# EAGLE schematic CHIP4 DUT Adapter Board (EAGLE 7.1.0)
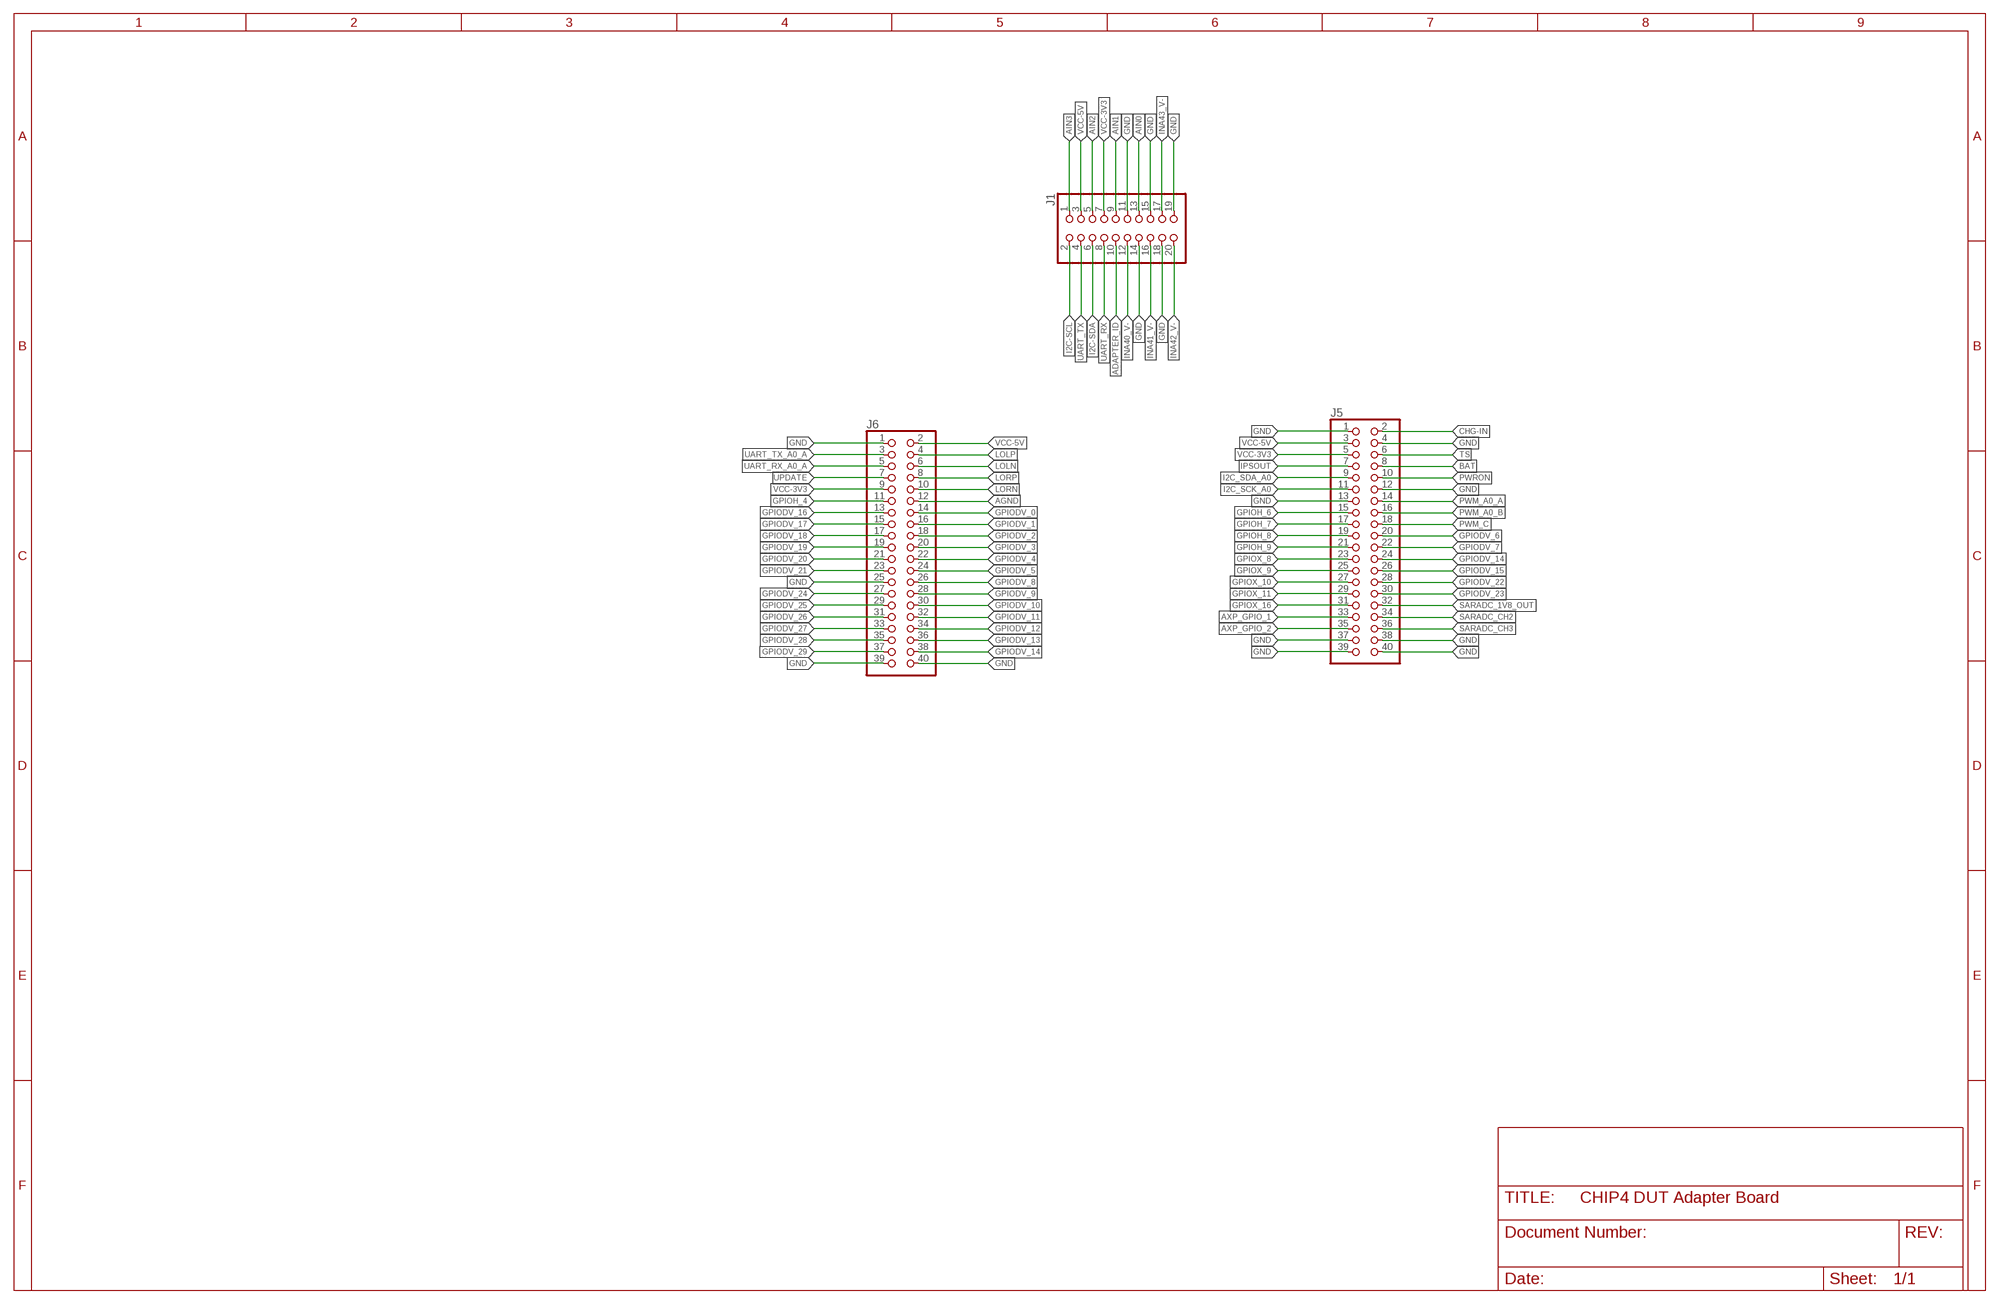
[diagram p0: schematic, sheet 1]

## Parts
J1  PINHD-2X10  [2X10]
J5  PINHD-2X20  [2X20]
J6  PINHD-2X20  [2X20]

## Nets
ADAPTER_ID: J1.10
AGND: J6.12
AIN0: J1.13
AIN1: J1.9
AIN2: J1.5
AIN3: J1.1
AXP_GPIO_1: J5.33
AXP_GPIO_2: J5.35
BAT: J5.8
CHG-IN: J5.2
GND: J1.11 J1.14 J1.15 J1.18 J1.19 J5.1 J5.4 J5.12 J5.13 J5.37 J5.38 J5.39 J5.40 J6.1 J6.25 J6.39 J6.40
GPIODV_0: J6.14
GPIODV_1: J6.16
GPIODV_2: J6.18
GPIODV_3: J6.20
GPIODV_4: J6.22
GPIODV_5: J6.24
GPIODV_6: J5.20
GPIODV_7: J5.22
GPIODV_8: J6.26
GPIODV_9: J6.28
GPIODV_10: J6.30
GPIODV_11: J6.32
GPIODV_12: J6.34
GPIODV_13: J6.36
GPIODV_14: J5.24 J6.38
GPIODV_15: J5.26
GPIODV_16: J6.13
GPIODV_17: J6.15
GPIODV_18: J6.17
GPIODV_19: J6.19
GPIODV_20: J6.21
GPIODV_21: J6.23
GPIODV_22: J5.28
GPIODV_23: J5.30
GPIODV_24: J6.27
GPIODV_25: J6.29
GPIODV_26: J6.31
GPIODV_27: J6.33
GPIODV_28: J6.35
GPIODV_29: J6.37
GPIOH_4: J6.11
GPIOH_6: J5.15
GPIOH_7: J5.17
GPIOH_8: J5.19
GPIOH_9: J5.21
GPIOX_8: J5.23
GPIOX_9: J5.25
GPIOX_10: J5.27
GPIOX_11: J5.29
GPIOX_16: J5.31
I2C-SCL: J1.2
I2C-SDA: J1.6
I2C_SCK_A0: J5.11
I2C_SDA_A0: J5.9
INA40_V-: J1.12
INA41_V-: J1.16
INA42_V-: J1.20
INA43_V-: J1.17
IPSOUT: J5.7
LOLN: J6.6
LOLP: J6.4
LORN: J6.10
LORP: J6.8
PWM_A0_A: J5.14
PWM_A0_B: J5.16
PWM_C: J5.18
PWRON: J5.10
SARADC_1V8_OUT: J5.32
SARADC_CH2: J5.34
SARADC_CH3: J5.36
TS: J5.6
UART_RX: J1.8
UART_RX_A0_A: J6.5
UART_TX: J1.4
UART_TX_A0_A: J6.3
UPDATE: J6.7
VCC-3V3: J1.7 J5.5 J6.9
VCC-5V: J1.3 J5.3 J6.2

## Library data of the parts
J1 = pinhead:PINHD-2X10: PIN HEADER
J5 J6 = pinhead:PINHD-2X20: PIN HEADER